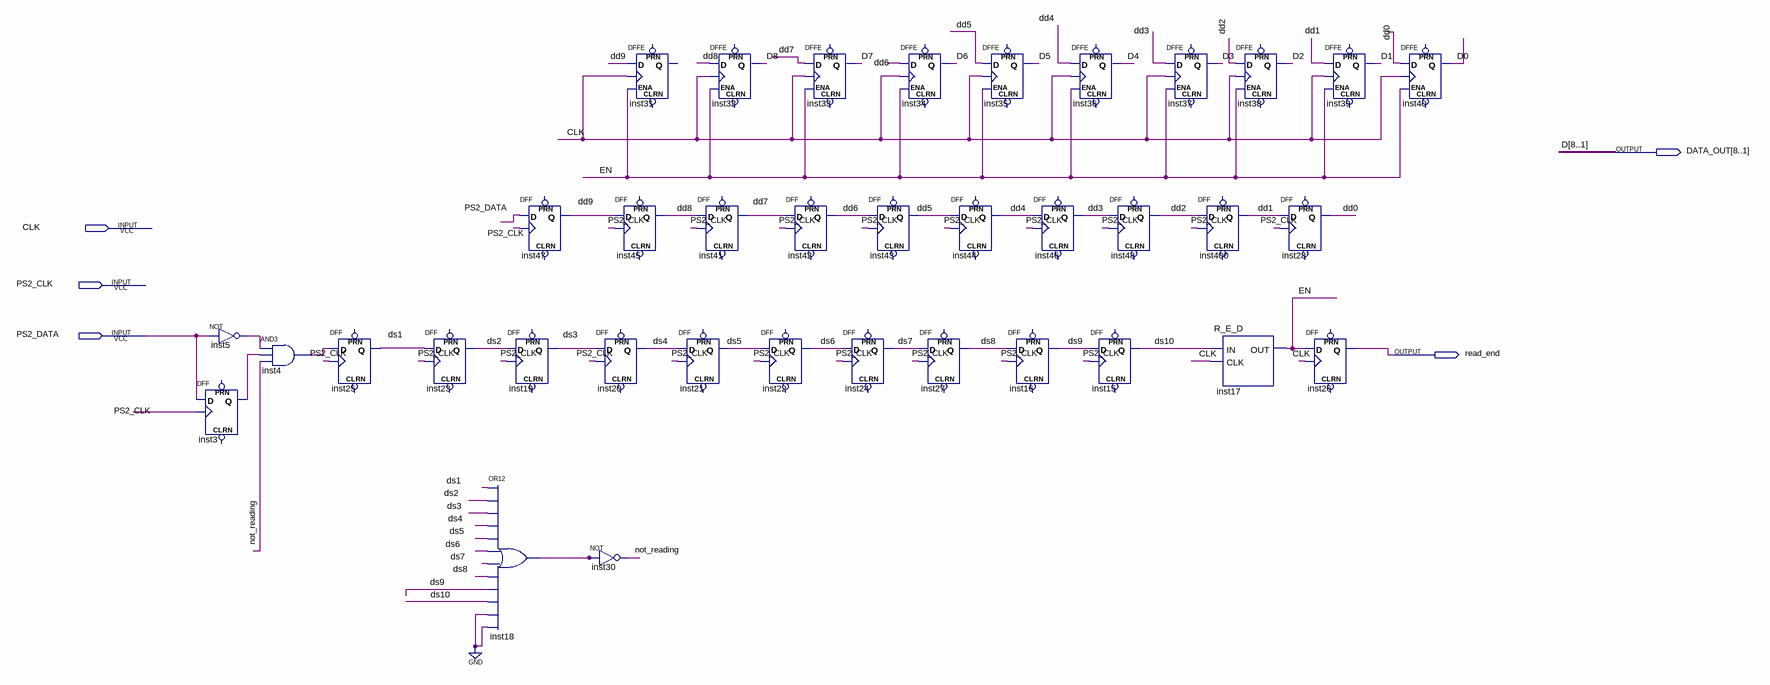
[diagram p0: schematic sheet]
// Quartus schematic PS2Controller.bdf as structural Verilog: 37 symbols, 5 pins
module PS2Controller (
  input  CLK,
  input  PS2_CLK,
  input  PS2_DATA,
  output [8:1] DATA_OUT,
  output read_end
);

  wire D0, dd0, dd1, dd2, dd3, dd4, dd5, dd6, dd7, dd8, dd9, ds1, ds2, ds3, ds4, ds5, ds6, ds7, ds8, ds9,
       ds10, EN, inst3_q, inst4_out, inst5_out, inst18_out, not_reading;

  not inst5 (inst5_out, PS2_DATA);
  DFF inst3 (.CLK(PS2_CLK), .D(PS2_DATA), .Q(inst3_q));  // open: CLRN, PRN
  and inst4 (inst4_out, inst5_out, inst3_q, not_reading);
  DFF inst25 (.CLK(PS2_CLK), .D(inst4_out), .Q(ds1));  // open: CLRN, PRN
  DFF inst23 (.CLK(PS2_CLK), .D(ds1), .Q(ds2));  // open: CLRN, PRN
  DFF inst47 (.CLK(PS2_CLK), .D(PS2_DATA), .Q(dd9));  // open: CLRN, PRN
  DFF inst19 (.CLK(PS2_CLK), .D(ds2), .Q(ds3));  // open: CLRN, PRN
  or inst18 (inst18_out, ds1, ds2, ds3, ds4, ds5, ds6, ds7, ds8, ds9, ds10, 1'b0, 1'b0);
  DFFE inst31 (.D(dd9), .CLK(CLK), .ENA(EN));  // open: PRN, CLRN, Q
  DFF inst45 (.CLK(PS2_CLK), .D(dd9), .Q(dd8));  // open: CLRN, PRN
  DFF inst20 (.CLK(PS2_CLK), .D(ds3), .Q(ds4));  // open: CLRN, PRN
  not inst30 (not_reading, inst18_out);
  DFF inst21 (.CLK(PS2_CLK), .D(ds4), .Q(ds5));  // open: CLRN, PRN
  DFFE inst32 (.D(dd8), .CLK(CLK), .ENA(EN), .Q(DATA_OUT[8]));  // open: PRN, CLRN
  DFF inst41 (.CLK(PS2_CLK), .D(dd8), .Q(dd7));  // open: CLRN, PRN
  DFF inst42 (.CLK(PS2_CLK), .D(dd7), .Q(dd6));  // open: CLRN, PRN
  DFF inst22 (.CLK(PS2_CLK), .D(ds5), .Q(ds6));  // open: CLRN, PRN
  DFFE inst33 (.D(dd7), .CLK(CLK), .ENA(EN), .Q(DATA_OUT[7]));  // open: PRN, CLRN
  DFF inst43 (.CLK(PS2_CLK), .D(dd6), .Q(dd5));  // open: CLRN, PRN
  DFF inst24 (.CLK(PS2_CLK), .D(ds6), .Q(ds7));  // open: CLRN, PRN
  DFFE inst34 (.D(dd6), .CLK(CLK), .ENA(EN), .Q(DATA_OUT[6]));  // open: PRN, CLRN
  DFF inst27 (.CLK(PS2_CLK), .D(ds7), .Q(ds8));  // open: CLRN, PRN
  DFFE inst35 (.D(dd5), .CLK(CLK), .ENA(EN), .Q(DATA_OUT[5]));  // open: PRN, CLRN
  DFF inst44 (.CLK(PS2_CLK), .D(dd5), .Q(dd4));  // open: CLRN, PRN
  DFF inst46 (.CLK(PS2_CLK), .D(dd4), .Q(dd3));  // open: CLRN, PRN
  DFF inst16 (.CLK(PS2_CLK), .D(ds8), .Q(ds9));  // open: CLRN, PRN
  DFFE inst36 (.D(dd4), .CLK(CLK), .ENA(EN), .Q(DATA_OUT[4]));  // open: PRN, CLRN
  DFF inst15 (.CLK(PS2_CLK), .D(ds9), .Q(ds10));  // open: CLRN, PRN
  DFF inst48 (.CLK(PS2_CLK), .D(dd3), .Q(dd2));  // open: CLRN, PRN
  DFFE inst37 (.D(dd3), .CLK(CLK), .ENA(EN), .Q(DATA_OUT[3]));  // open: PRN, CLRN
  DFFE inst38 (.D(dd2), .CLK(CLK), .ENA(EN), .Q(DATA_OUT[2]));  // open: PRN, CLRN
  DFF inst400 (.CLK(PS2_CLK), .D(dd2), .Q(dd1));  // open: CLRN, PRN
  R_E_D inst17 (.IN(ds10), .CLK(CLK), .OUT(EN));
  DFF inst28 (.CLK(PS2_CLK), .D(dd1), .Q(dd0));  // open: CLRN, PRN
  DFFE inst39 (.D(dd1), .CLK(CLK), .ENA(EN), .Q(DATA_OUT[1]));  // open: PRN, CLRN
  DFF inst26 (.CLK(CLK), .D(EN), .Q(read_end));  // open: CLRN, PRN
  DFFE inst40 (.D(dd0), .CLK(CLK), .ENA(EN), .Q(D0));  // open: PRN, CLRN

  // Other names for the same wires on the sheet: D[8:1] = DATA_OUT; D1 = DATA_OUT[1]; D2 = DATA_OUT[2];
  //   D3 = DATA_OUT[3]; D4 = DATA_OUT[4]; D5 = DATA_OUT[5]; D6 = DATA_OUT[6]; D7 = DATA_OUT[7]; D8 = DATA_OUT[8]
endmodule
